# Altium schematic sheet BoardIO.SchDoc: Board I/O
size Letter; Engineer: Nathan Petersen; DocumentNumber: 11; Revision: v1.2; SheetNumber: 11; SheetTotal: 23
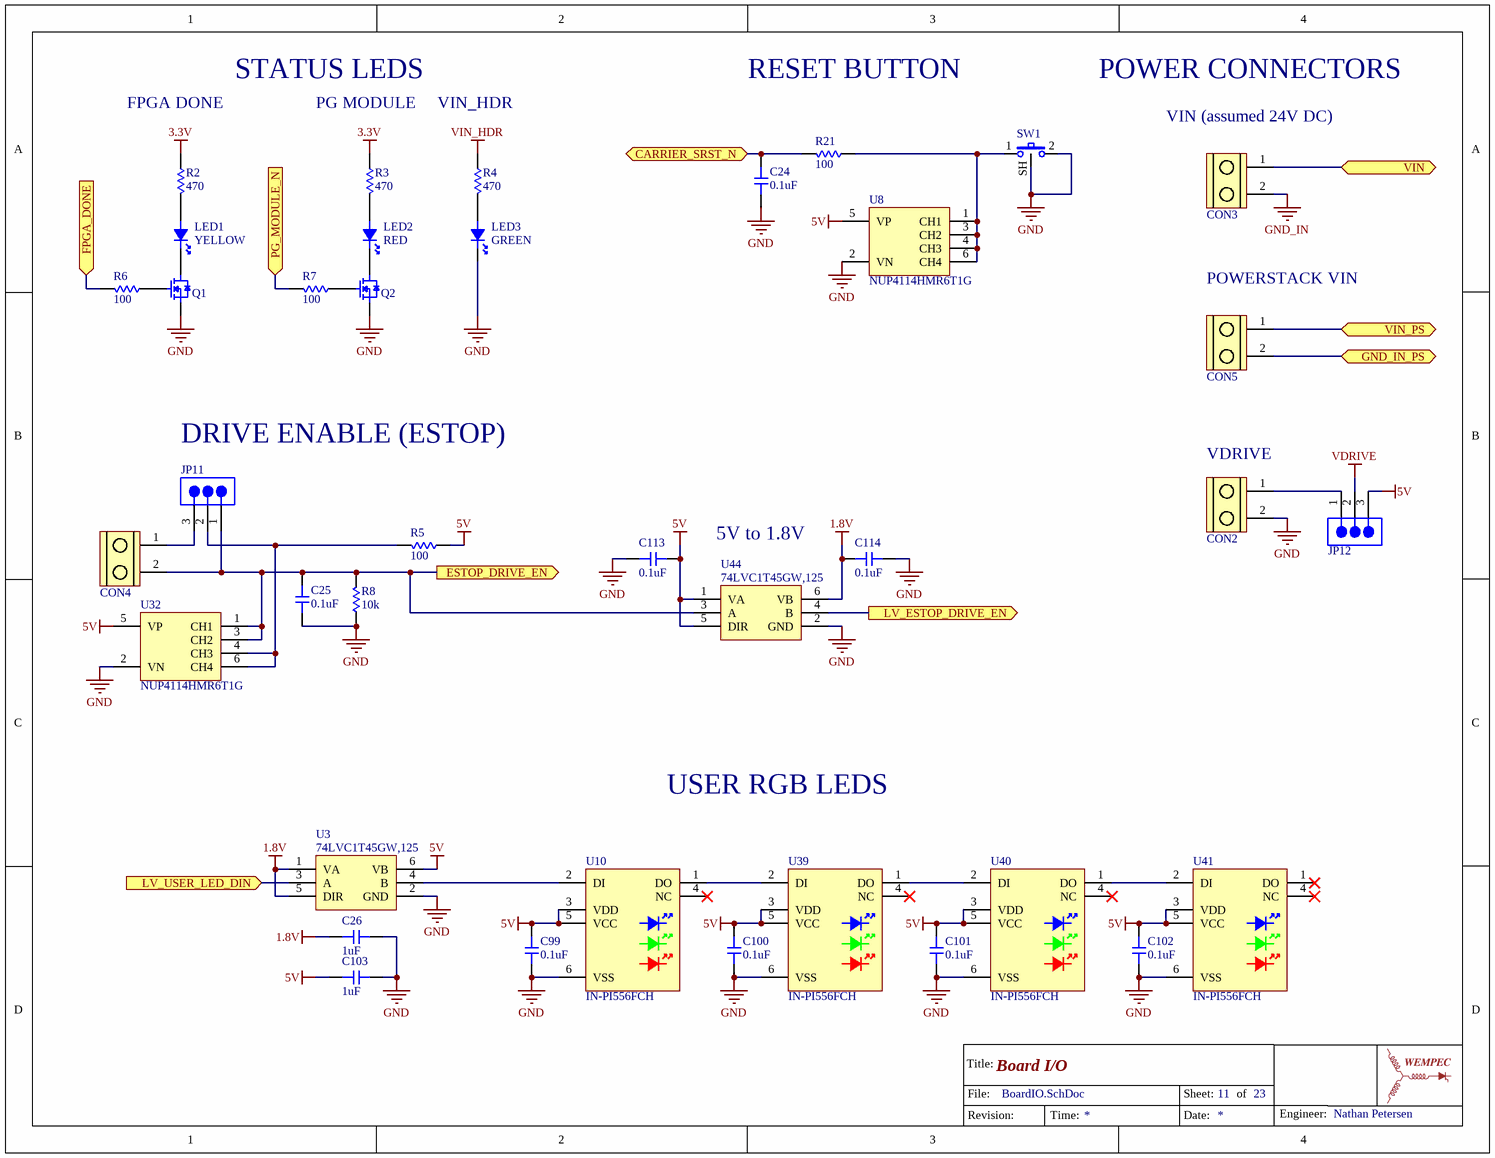
[diagram p0: BoardIO.SchDoc]

## Parts
C24  value 0.1uF  [0603-CAP]  (hidden comment: Capacitor)
C25  value 0.1uF  [0603-CAP]  (hidden comment: Capacitor)
C26  value 1uF  [0603-CAP]  (hidden comment: Capacitor)
C99  value 0.1uF  [0603-CAP]  (hidden comment: Capacitor)
C100  value 0.1uF  [0603-CAP]  (hidden comment: Capacitor)
C101  value 0.1uF  [0603-CAP]  (hidden comment: Capacitor)
C102  value 0.1uF  [0603-CAP]  (hidden comment: Capacitor)
C103  value 1uF  [0603-CAP]  (hidden comment: Capacitor)
C113  value 0.1uF  [0603-CAP]  (hidden comment: Capacitor)
C114  value 0.1uF  [0603-CAP]  (hidden comment: Capacitor)
CON2  ScrewTerminal_1x2  [1935161]  (value not drawn)
CON3  ScrewTerminal_1x2  [1935161]  (value not drawn)
CON4  ScrewTerminal_1x2  [1935161]  (value not drawn)
CON5  ScrewTerminal_1x2  [1935161]  (value not drawn)
JP11  Jumper3  [PIN_HEADER_1X3]  (value not drawn)
JP12  Jumper3  [PIN_HEADER_1X3]  (value not drawn)
LED1  value YELLOW  [0603-LED]  (hidden comment: LED)
LED2  value RED  [0603-LED]  (hidden comment: LED)
LED3  value GREEN  [0603-LED]  (hidden comment: LED)
Q1  MOSFET  [SOT95P245X110-3N]  (value not drawn)
Q2  MOSFET  [SOT95P245X110-3N]  (value not drawn)
R2  value 470  [0603-RES]  (hidden comment: Resistor)
R3  value 470  [0603-RES]  (hidden comment: Resistor)
R4  value 470  [0603-RES]  (hidden comment: Resistor)
R5  value 100  [0603-RES]  (hidden comment: Resistor)
R6  value 100  [0603-RES]  (hidden comment: Resistor)
R7  value 100  [0603-RES]  (hidden comment: Resistor)
R8  value 10k  [0603-RES]  (hidden comment: Resistor)
R21  value 100  [0603-RES]  (hidden comment: Resistor)
SW1  1825027-5  [1825027-5]  (value not drawn)
U3  74LVC1T45GW,125  [SOT65P210X110-6N]
U8  NUP4114HMR6T1G  [TSOP95P280X110-6N]
U10  IN-PI556FCH  [IN-PI556FCH]
U32  NUP4114HMR6T1G  [TSOP95P280X110-6N]
U39  IN-PI556FCH  [IN-PI556FCH]
U40  IN-PI556FCH  [IN-PI556FCH]
U41  IN-PI556FCH  [IN-PI556FCH]
U44  74LVC1T45GW,125  [SOT65P210X110-6N]

## Ports
CARRIER_SRST_N (bidir), ESTOP_DRIVE_EN (out), FPGA_DONE (in), GND_IN_PS (bidir), LV_ESTOP_DRIVE_EN (out), LV_USER_LED_DIN (in), PG_MODULE_N (in), VIN (bidir), VIN_PS (bidir)

## Nets
1.8V: C26.1 C114.1 U3.1(VA) U3.5(DIR) U44.6(VB)
3.3V: R2.1 R3.1
5V: C99.2 C100.2 C101.2 C102.2 C103.1 C113.2 JP12.3 R5.1 U3.6(VB) U8.5(VP) U10.3(VDD) U10.5(VCC) U32.5(VP) U39.3(VDD) U39.5(VCC) U40.3(VDD) U40.5(VCC) U41.3(VDD) U41.5(VCC) U44.1(VA) U44.5(DIR)
GND: C24.1 C25.1 C26.2 C99.1 C100.1 C101.1 C102.1 C103.2 C113.1 C114.2 CON2.2 LED3.C Q1.2(S) Q2.2(S) R8.1 SW1.2 SW1.SH U3.2(GND) U8.2(VN) U10.6(VSS) U32.2(VN) U39.6(VSS) U40.6(VSS) U41.6(VSS) U44.2(GND)
GND_IN: CON3.2
VDRIVE: JP12.2
VIN_HDR: R4.1
CARRIER_SRST_N: C24.2 R21.2 ; port CARRIER_SRST_N
ESTOP_DRIVE_EN: C25.2 CON4.2 JP11.1 R8.2 U32.1(CH1) U32.3(CH2) U44.3(A) ; port ESTOP_DRIVE_EN
FPGA_DONE: R6.2 ; port FPGA_DONE
GND_IN_PS: CON5.2 ; port GND_IN_PS
LV_ESTOP_DRIVE_EN: U44.4(B) ; port LV_ESTOP_DRIVE_EN
LV_USER_LED_DIN: U3.3(A) ; port LV_USER_LED_DIN
PG_MODULE_N: R7.2 ; port PG_MODULE_N
VIN: CON3.1 ; port VIN
VIN_PS: CON5.1 ; port VIN_PS
NetCON2_1: CON2.1 JP12.1
NetCON4_1: CON4.1 JP11.3
NetJP11_2: JP11.2 R5.2 U32.4(CH3) U32.6(CH4)
NetLED1_A: LED1.A R2.2
NetLED1_C: LED1.C Q1.3(D)
NetLED2_A: LED2.A R3.2
NetLED2_C: LED2.C Q2.3(D)
NetLED3_A: LED3.A R4.2
NetQ1_1: Q1.1(G) R6.1
NetQ2_1: Q2.1(G) R7.1
NetR21_1: R21.1 SW1.1 U8.1(CH1) U8.3(CH2) U8.4(CH3) U8.6(CH4)
NetU3_4: U3.4(B) U10.2(DI)
NetU10_1: U10.1(DO) U39.2(DI)
NetU39_1: U39.1(DO) U40.2(DI)
NetU40_1: U40.1(DO) U41.2(DI)

Not connected (* = marked no-connect by the designer): U10 4(NC)*; U39 4(NC)*; U40 4(NC)*; U41 1(DO)* 4(NC)*

## Notes on the sheet
- STATUS LEDS
- RESET BUTTON
- POWER CONNECTORS
- FPGA DONE
- PG MODULE
- VIN_HDR
- (near CON3) VIN (assumed 24V DC)
- (near CON5) POWERSTACK VIN
- DRIVE ENABLE (ESTOP)
- (near CON2) VDRIVE
- 5V to 1.8V
- USER RGB LEDS
- Title:
- File:
- Sheet:
- of
- Revision:
- Time:
- Date:
- Engineer:

## Library data of the parts
SW1 = 1825027-5: SWITCH TACTILE SPST-NO 0.05A 24V; Supplier 1: Digi-Key; Supplier Part Number 1: 450-1662-ND
U3 U44 = 74LVC1T45GW,125: TXRX XLATING DUAL 3ST 6TSSOP; Supplier 1: Digi-Key; Supplier Part Number 1: 1727-4560-1-ND
U8 U32 = NUP4114HMR6T1G: TVS DIODE 5.5V 10V 6TSOP; Supplier 1: Digi-Key; Supplier Part Number 1: NUP4114HMR6T1GOSCT-ND
U10 U39-U41 = IN-PI556FCH: LED RGB 5050 SMD; Supplier 1: Digi-Key; Supplier Part Number 1: 1830-1107-1-ND
C24-C26 C99-C103 C113 C114 = Capacitor: Supplier 1: Digi-Key
  C24 C25 C99-C102 C113 C114: Supplier Part Number 1: 1276-1012-6-ND
  C26 C103: Supplier Part Number 1: 1276-6524-6-ND
CON2-CON5 = ScrewTerminal_1x2: Supplier 1: Digi-Key; Supplier Part Number 1: 277-1667-ND
JP11 JP12 = Jumper3: Supplier 1: Digi-Key; Supplier Part Number 1: 732-5316-ND
LED1-LED3 = LED: Supplier 1: Digi-Key
  LED1: Supplier Part Number 1: 160-1448-6-ND
  LED2: Supplier Part Number 1: 160-1447-6-ND
  LED3: Supplier Part Number 1: 160-1446-6-ND
Q1 Q2 = MOSFET: Supplier 1: Digi-Key; Supplier Part Number 1: FDV301NCT-ND
R2-R8 R21 = Resistor: Supplier 1: Digi-Key
  R2-R4: Supplier Part Number 1: 311-470LDCT-ND
  R5-R7 R21: Supplier Part Number 1: YAG3561DKR-ND
  R8: Supplier Part Number 1: P10.0KHCT-ND